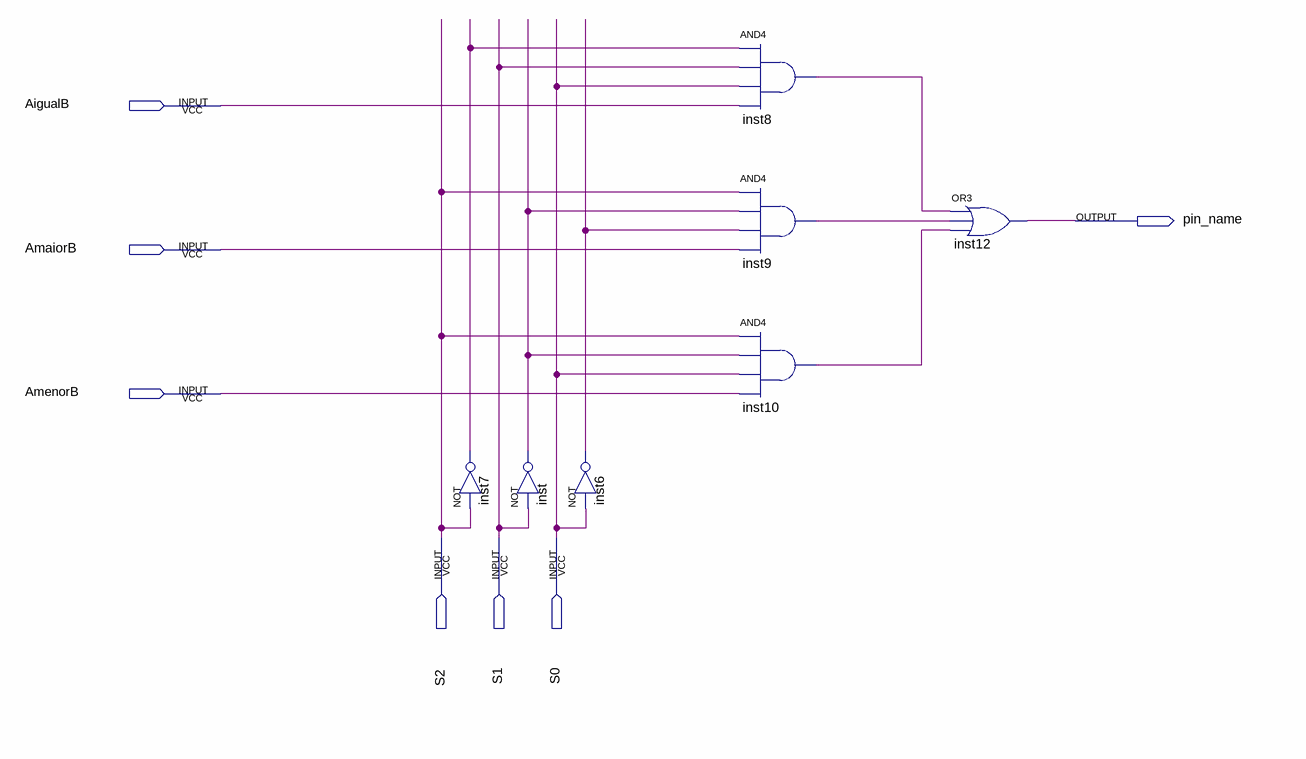
[diagram p0: schematic sheet]
// Quartus schematic Mux3x1.bdf as structural Verilog: 7 symbols, 7 pins
module Mux3x1 (
  input  AigualB,
  input  AmaiorB,
  input  AmenorB,
  input  S2,
  input  S1,
  input  S0,
  output pin_name
);

  wire inst6_out, inst7_out, inst8_out, inst9_out, inst10_out, inst_out;

  not inst7 (inst7_out, S2);
  not inst (inst_out, S1);
  not inst6 (inst6_out, S0);
  and inst8 (inst8_out, inst7_out, S1, S0, AigualB);
  and inst9 (inst9_out, S2, inst_out, inst6_out, AmaiorB);
  and inst10 (inst10_out, S2, inst_out, S0, AmenorB);
  or inst12 (pin_name, inst8_out, inst9_out, inst10_out);
endmodule
